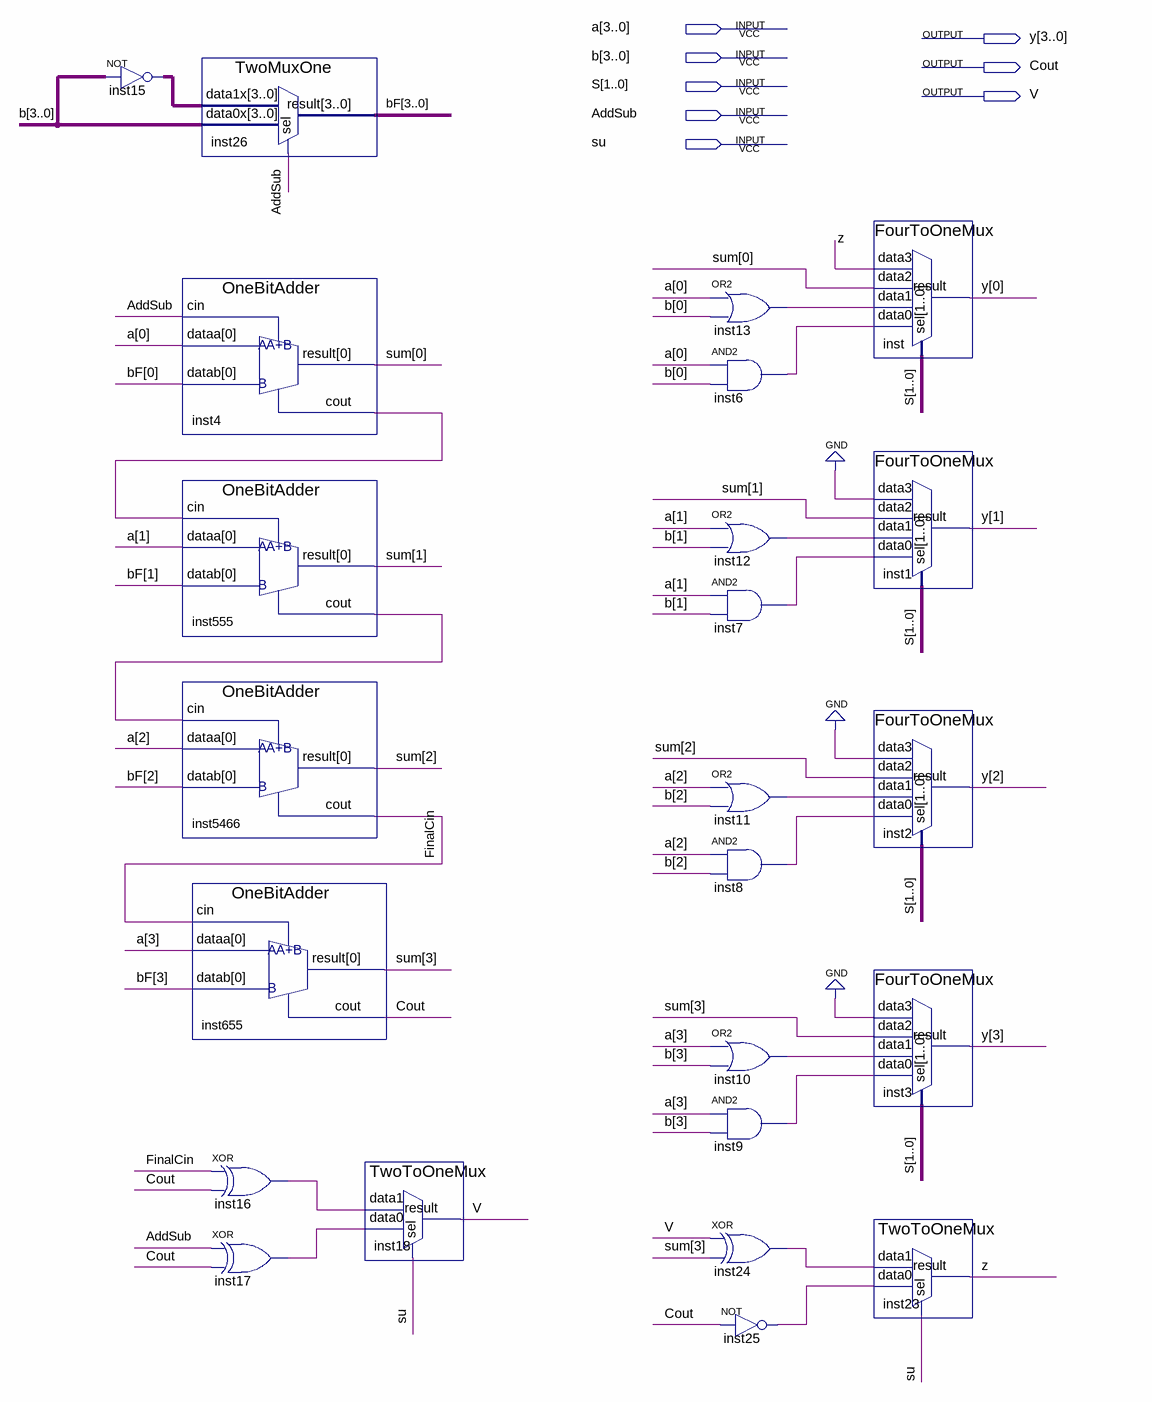
[diagram p0: schematic sheet]
// Quartus schematic ALUBitByBit.bdf as structural Verilog: 24 symbols, 8 pins
module ALUBitByBit (
  input  [3:0] a,
  input  [3:0] b,
  input  [1:0] S,
  input  AddSub,
  input  su,
  output [3:0] y,
  output Cout,
  output V
);

  wire FinalCin, inst4_cout, inst6_out, inst7_out, inst8_out, inst9_out, inst10_out, inst11_out, inst12_out,
       inst13_out, inst16_out, inst17_out, inst24_out, inst25_out, inst555_cout, z;
  wire [3:0] bF, inst15_out, sum;

  assign inst15_out = ~b;  // NOT inst15, 4 bits wide
  TwoMuxOne inst26 (.data1x(inst15_out), .data0x(b), .sel(AddSub), .result(bF));
  OneBitAdder inst4 (.cin(AddSub), .dataa(a[0]), .datab(bF[0]), .result(sum[0]), .cout(inst4_cout));
  OneBitAdder inst555 (.cin(inst4_cout), .dataa(a[1]), .datab(bF[1]), .result(sum[1]), .cout(inst555_cout));
  OneBitAdder inst5466 (.cin(inst555_cout), .dataa(a[2]), .datab(bF[2]), .result(sum[2]), .cout(FinalCin));
  OneBitAdder inst655 (.cin(FinalCin), .dataa(a[3]), .datab(bF[3]), .result(sum[3]), .cout(Cout));
  xor inst16 (inst16_out, FinalCin, Cout);
  xor inst17 (inst17_out, AddSub, Cout);
  TwoToOneMux inst18 (.data1(inst16_out), .data0(inst17_out), .sel(su), .result(V));
  or inst13 (inst13_out, a[0], b[0]);
  and inst6 (inst6_out, a[0], b[0]);
  or inst12 (inst12_out, a[1], b[1]);
  and inst7 (inst7_out, a[1], b[1]);
  or inst11 (inst11_out, a[2], b[2]);
  and inst8 (inst8_out, a[2], b[2]);
  or inst10 (inst10_out, a[3], b[3]);
  and inst9 (inst9_out, a[3], b[3]);
  xor inst24 (inst24_out, V, sum[3]);
  not inst25 (inst25_out, Cout);
  FourToOneMux inst (.data3(z), .data2(sum[0]), .data1(inst13_out), .data0(inst6_out), .sel(S), .result(y[0]));
  FourToOneMux inst1 (.data3(1'b0), .data2(sum[1]), .data1(inst12_out), .data0(inst7_out), .sel(S), .result(y[1]));
  FourToOneMux inst2 (.data3(1'b0), .data2(sum[2]), .data1(inst11_out), .data0(inst8_out), .sel(S), .result(y[2]));
  FourToOneMux inst3 (.data3(1'b0), .data2(sum[3]), .data1(inst10_out), .data0(inst9_out), .sel(S), .result(y[3]));
  TwoToOneMux inst23 (.data1(inst24_out), .data0(inst25_out), .sel(su), .result(z));
endmodule
